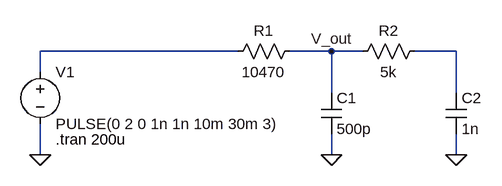
[diagram p0: schematic step_response.asc]
step_response.asc, the LTspice schematic file:
Version 4.1
SHEET 1 880 680
WIRE 112 16 -192 16
WIRE 256 16 192 16
WIRE 304 16 256 16
WIRE 448 16 384 16
WIRE -192 48 -192 16
WIRE 256 80 256 16
WIRE 448 80 448 16
WIRE -192 176 -192 128
WIRE 256 176 256 144
WIRE 448 176 448 144
FLAG 256 176 0
FLAG -192 176 0
FLAG 448 176 0
FLAG 256 16 V_out
SYMBOL res 208 0 R90
WINDOW 0 0 56 VBottom 2
WINDOW 3 32 56 VTop 2
SYMATTR InstName R1
SYMATTR Value 10470
SYMBOL res 400 0 R90
WINDOW 0 0 56 VBottom 2
WINDOW 3 32 56 VTop 2
SYMATTR InstName R2
SYMATTR Value 5k
SYMBOL cap 240 80 R0
SYMATTR InstName C1
SYMATTR Value 500p
SYMBOL cap 432 80 R0
SYMATTR InstName C2
SYMATTR Value 1n
SYMBOL voltage -192 32 R0
WINDOW 123 0 0 Left 0
WINDOW 39 0 0 Left 0
SYMATTR InstName V1
SYMATTR Value PULSE(0 2 0 1n 1n 10m 30m 3)
TEXT -168 152 Left 2 !.tran 200u

The netlist it stands for:
* step_response.asc
R1 V_out N001 10470
R2 N002 V_out 5k
C1 V_out 0 500p
C2 N002 0 1n
V1 N001 0 PULSE(0 2 0 1n 1n 10m 30m 3)
.tran 200u
.backanno
.end